# EAGLE design lada_v2 (EAGLE 7.2.0)
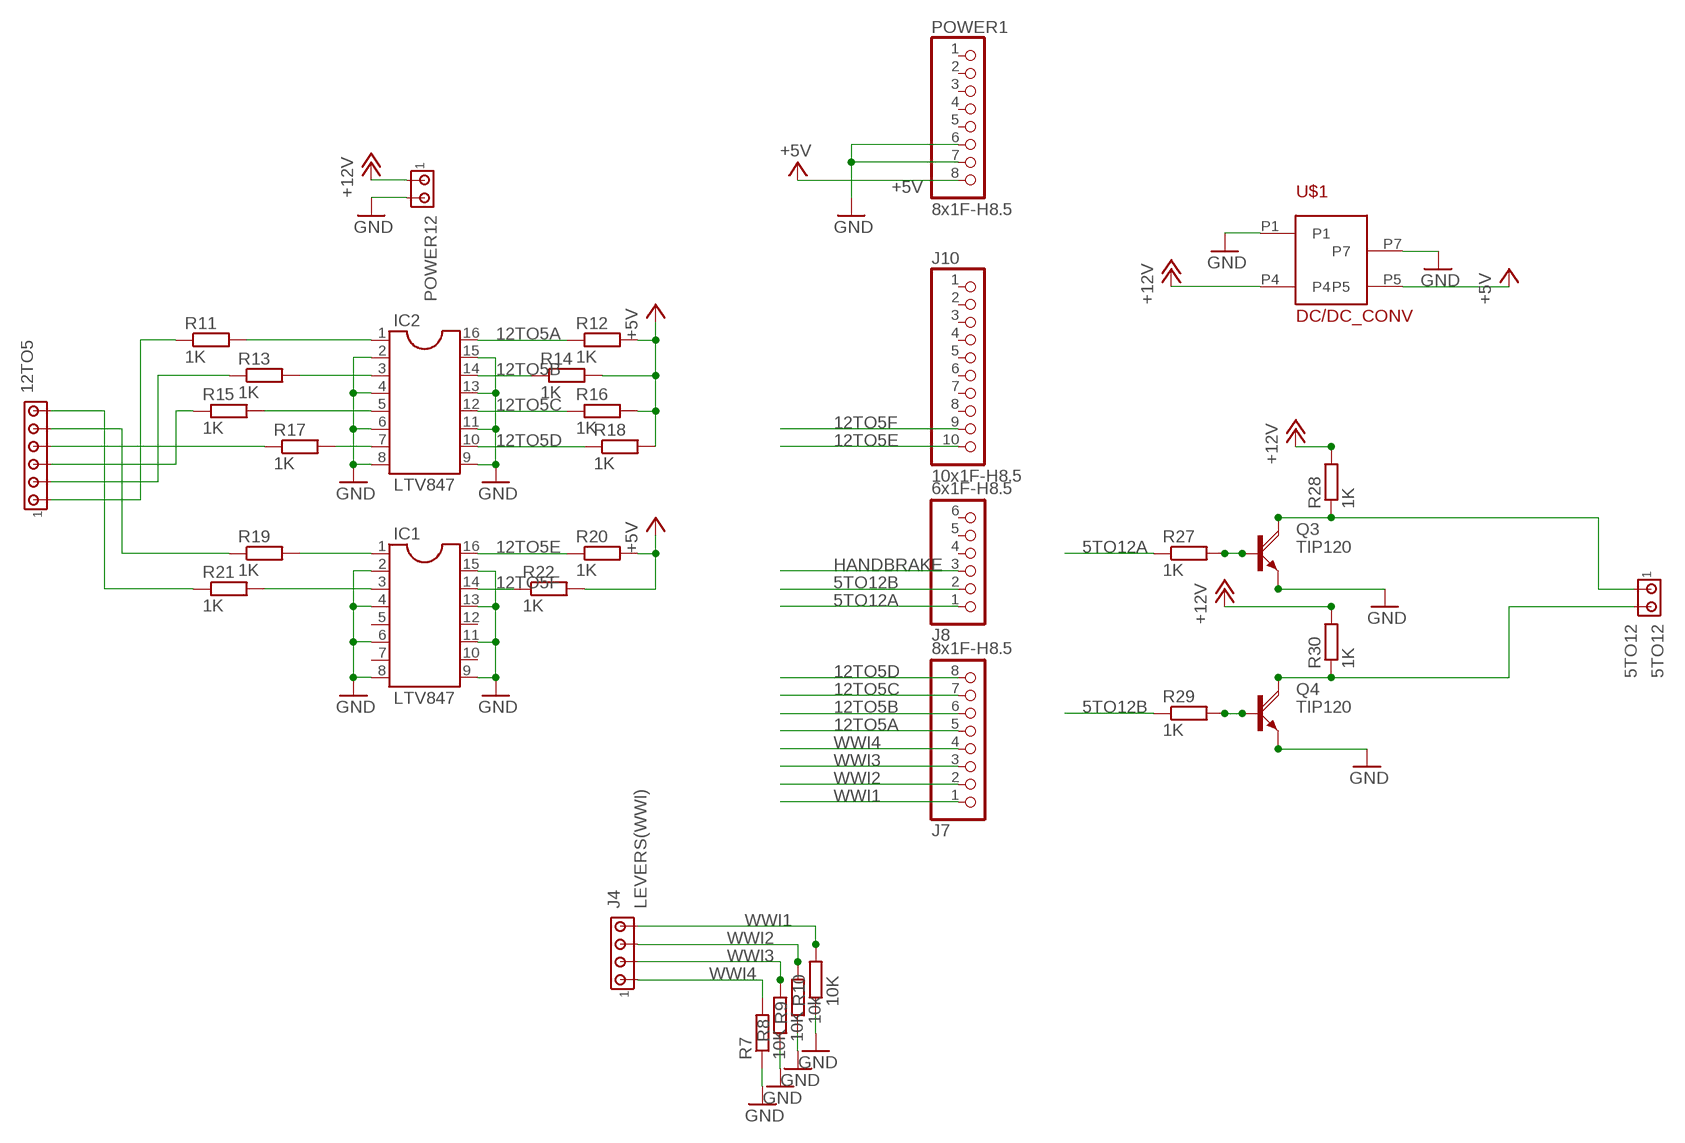
[diagram p0: schematic, sheet 1]

## Parts
5TO12  5TO12  MTA02-100  [10X02MTA]
12TO5  MTA06-100  [10X06MTA]
IC1  LTV847  DIL16  [DIL16]
IC2  LTV847  DIL16  [DIL16]
J4  LEVERS(WWI)  MTA04-100  [10X04MTA]
J7  8x1F-H8.5  PINHD-1X8  [1X08]
J8  6x1F-H8.5  PINHD-1X6  [1X06]
J10  10x1F-H8.5  PINHD-1X10  [1X10]
POWER1  8x1F-H8.5  PINHD-1X8  [1X08]
POWER12  MTA02-100  [10X02MTA]
Q3  TIP120  [TO220AH]
Q4  TIP120  [TO220AH]
R7  10K  R-EU_0207/10  [0207/10]
R8  10K  R-EU_0207/10  [0207/10]
R9  10k  R-EU_0207/10  [0207/10]
R10  10K  R-EU_0207/10  [0207/10]
R11  1K  R-EU_0207/10  [0207/10]
R12  1K  R-EU_0207/10  [0207/10]
R13  1K  R-EU_0207/10  [0207/10]
R14  1K  R-EU_0207/10  [0207/10]
R15  1K  R-EU_0207/10  [0207/10]
R16  1K  R-EU_0207/10  [0207/10]
R17  1K  R-EU_0207/10  [0207/10]
R18  1K  R-EU_0207/10  [0207/10]
R19  1K  R-EU_0207/10  [0207/10]
R20  1K  R-EU_0207/10  [0207/10]
R21  1K  R-EU_0207/10  [0207/10]
R22  1K  R-EU_0207/10  [0207/10]
R27  1K  R-EU_0207/10  [0207/10]
R28  1K  R-EU_0207/10  [0207/10]
R29  1K  R-EU_0207/10  [0207/10]
R30  1K  R-EU_0207/10  [0207/10]
U$1  DC/DC_CONV  [DC/DC_CONV]

## Nets
5TO12A: J8.1 R27.1
5TO12B: J8.2 R29.1
12TO5A: IC2.16 J7.5 R12.1
12TO5B: IC2.14 J7.6 R14.1
12TO5C: IC2.12 J7.7 R16.1
12TO5D: IC2.10 J7.8 R18.1
12TO5E: IC1.16 J10.10 R20.1
12TO5F: IC1.14 J10.9 R22.1
+5V: POWER1.8 R12.2 R14.2 R16.2 R18.2 R20.2 R22.2 U$1.P5
+12V: POWER12.1 R28.2 R30.2 U$1.P4
GND: IC1.2 IC1.4 IC1.6 IC1.8 IC1.9 IC1.11 IC1.13 IC1.15 IC2.2 IC2.4 IC2.6 IC2.8 IC2.9 IC2.11 IC2.13 IC2.15 POWER1.6 POWER1.7 POWER12.2 Q3.E Q4.E R7.1 R8.1 R9.1 R10.1 U$1.P1 U$1.P7
HANDBRAKE: J8.3
N$60: 5TO12.1 Q3.C R28.1
N$61: 5TO12.2 Q4.C R30.1
N$64: Q4.B R29.2
N$65: Q3.B R27.2
N$120: IC1.1 R19.2
N$121: IC1.3 R21.2
N$128: IC2.1 R11.2
N$129: IC2.3 R13.2
N$130: IC2.5 R15.2
N$131: IC2.7 R17.2
N$132: 12TO5.1 R11.1
N$133: 12TO5.2 R13.1
N$134: 12TO5.3 R15.1
N$135: 12TO5.4 R17.1
N$136: 12TO5.5 R19.1
N$137: 12TO5.6 R21.1
WWI1: J4.4 J7.1 R10.2
WWI2: J4.3 J7.2 R9.2
WWI3: J4.2 J7.3 R8.2
WWI4: J4.1 J7.4 R7.2
Unconnected: IC1.5 IC1.7 IC1.10 IC1.12 J8.4 J8.5 J8.6 J10.1 J10.2 J10.3 J10.4 J10.5 J10.6 J10.7 J10.8 POWER1.1 POWER1.2 POWER1.3 POWER1.4 POWER1.5

## Library data of the parts
5TO12 POWER12 = con-amp:MTA02-100: AMP connector
12TO5 = con-amp:MTA06-100: AMP connector Connection corrected 2014-09-19
IC1 IC2 = ic-package:DIL16: Dual In Line / Socket
J4 = con-amp:MTA04-100: AMP connector
J7 POWER1 = SmartPrj:PINHD-1X8: PIN HEADER
J8 = SmartPrj:PINHD-1X6: PIN HEADER
J10 = SmartPrj:PINHD-1X10: PIN HEADER
Q3 Q4 = transistor-power:TIP120: NPN DARLINGTON TRANSISTOR
R7-R22 R27-R30 = rcl:R-EU_: RESISTOR, European symbol
U$1 = dc-dc_meanwell:DC/DC_CONV

## Net classes
0 default: width 0.152 mm, drill 0.61 mm, clearance 0.152 mm
1 power: width 0.152 mm, drill 0.61 mm, clearance 0.152 mm
2 VIN: width 0.61 mm, drill 0.61 mm, clearance 0.254 mm

## Board
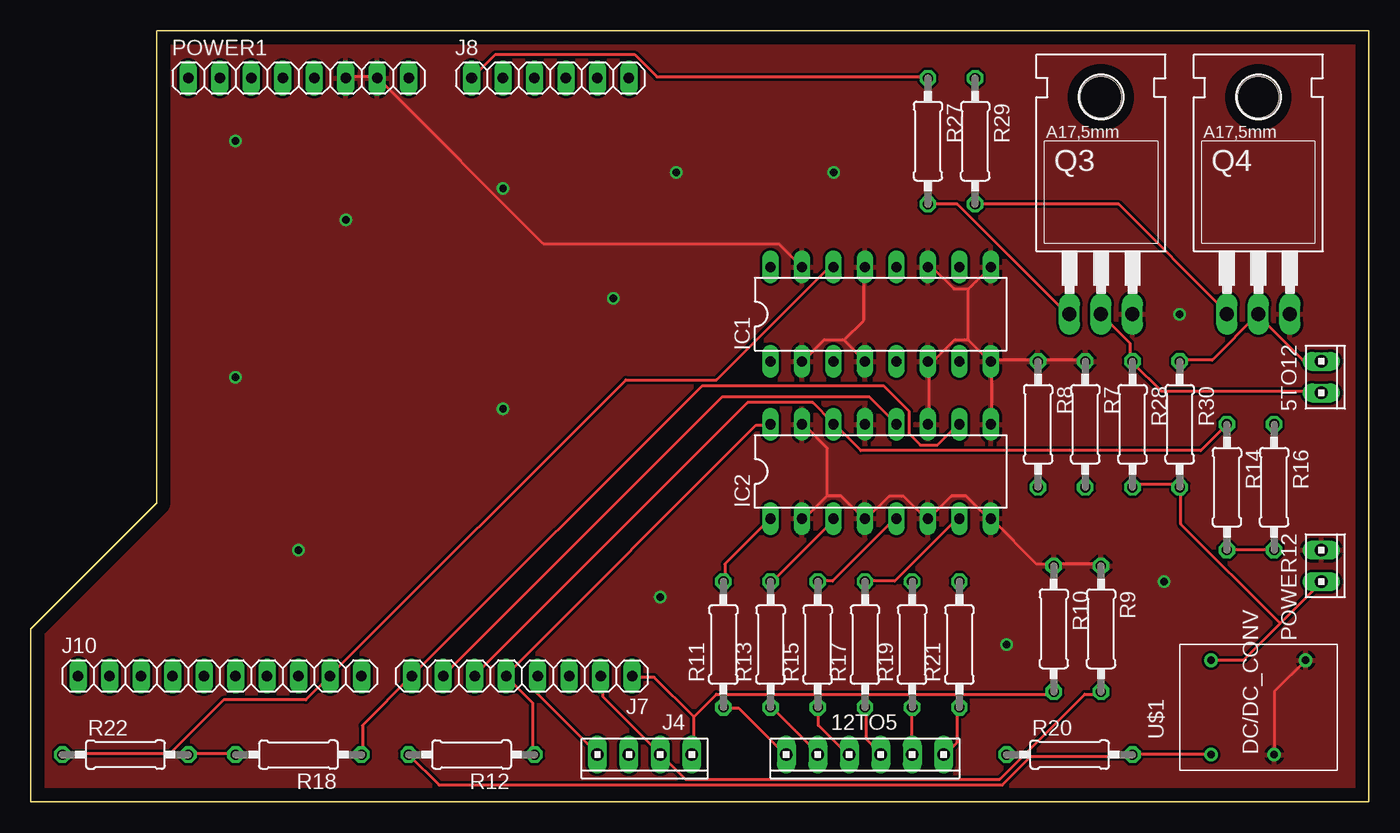
[diagram p1: board, top side]
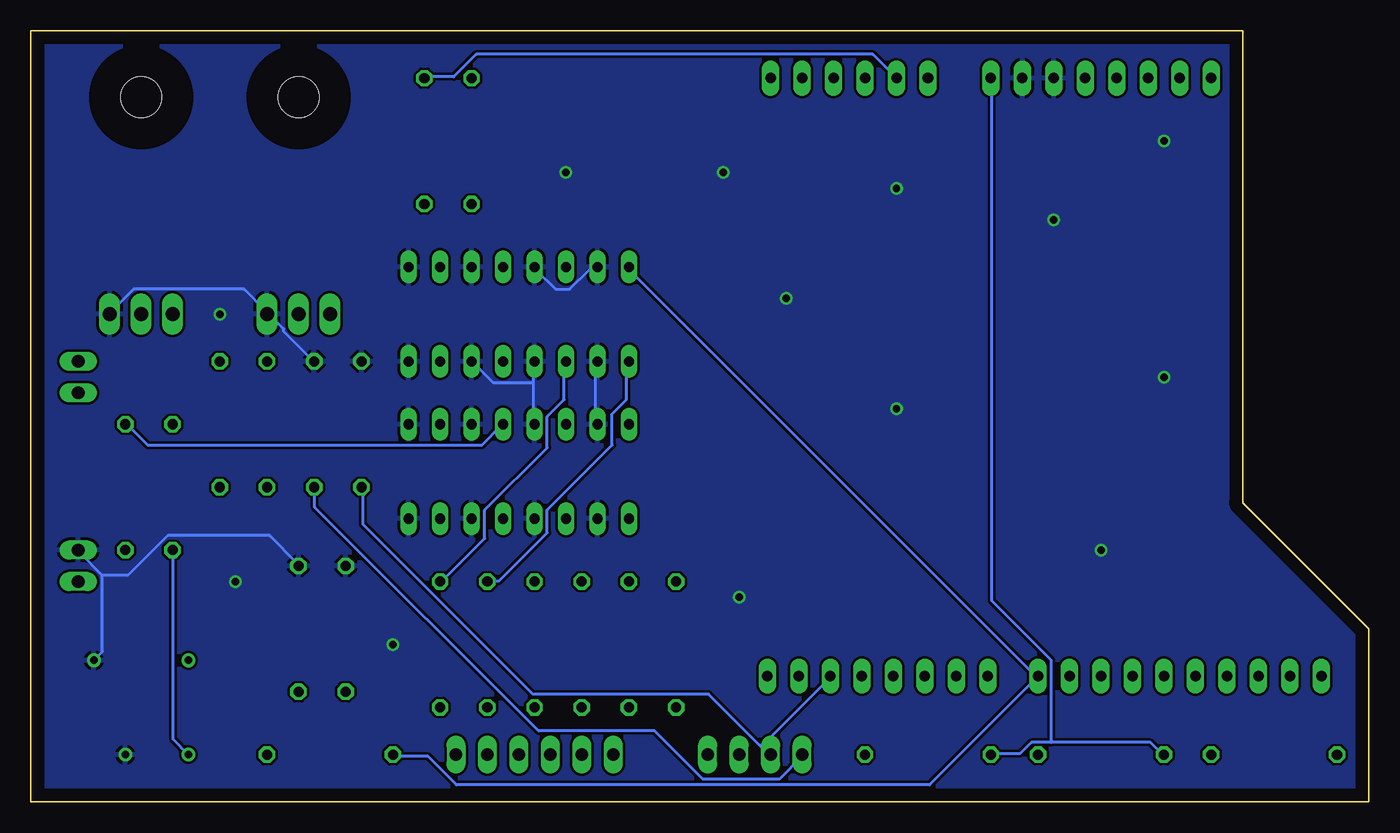
[diagram p2: board, bottom side, seen from below]

Size 107.95 x 62.23 mm. Coordinates in mm from the lower left corner, seen from the top.
Outline: 10.16,62.23 10.16,24.13 0,13.97 0,0 107.95,0 107.95,62.23 10.16,62.23
Copper layers (1*16): Top 0.035mm / dielectric 1.5mm / Bottom 0.035mm
Design rules "default *": minimum track width 10mil, minimum drill 20mil, track to track 8mil, track to pad 8mil, pad to pad 8mil, via to via 8mil, smd to smd 8mil, copper to edge 40mil, drill to drill 8mil, minimum pad ring 10mil, minimum via ring 8mil, stop-mask expansion 4mil, vias tented up to drill 0mil, thermal gap 10mil

### Footprints (pad centres in the part's own frame; a part is rotated, then mirrored left to right if it is on the bottom)
10X02MTA = drill 1.016 long: 1 1.27,0; 2 -1.27,0
10X06MTA = drill 1.016 long: 1 6.35,0; 2 3.81,0; 3 1.27,0; 4 -1.27,0; 5 -3.81,0; 6 -6.35,0
DIL16 = drill 0.813 long: 1 -8.89,-3.81; 2 -6.35,-3.81; 3 -3.81,-3.81; 4 -1.27,-3.81; 5 1.27,-3.81; 6 3.81,-3.81; 7 6.35,-3.81; 8 8.89,-3.81; 9 8.89,3.81; 10 6.35,3.81; 11 3.81,3.81; 12 1.27,3.81; 13 -1.27,3.81; 14 -3.81,3.81; 15 -6.35,3.81; 16 -8.89,3.81
10X04MTA = drill 1.016 long: 1 3.81,0; 2 1.27,0; 3 -1.27,0; 4 -3.81,0
1X08 = drill 0.85 pad 1.422 long: 1 -8.89,0; 2 -6.35,0; 3 -3.81,0; 4 -1.27,0; 5 1.27,0; 6 3.81,0; 7 6.35,0; 8 8.89,0
1X06 = drill 0.85 pad 1.422 long: 1 -6.35,0; 2 -3.81,0; 3 -1.27,0; 4 1.27,0; 5 3.81,0; 6 6.35,0
1X10 = drill 0.85 pad 1.422 long: 1 -11.43,0; 2 -8.89,0; 3 -6.35,0; 4 -3.81,0; 5 -1.27,0; 6 1.27,0; 7 3.81,0; 8 6.35,0; 9 8.89,0; 10 11.43,0
TO220AH = drill 1.118 long: B -2.54,-6.35; C 0,-6.35; E 2.54,-6.35 | hole 3.302: 0,11.176
0207/10 = drill 0.813 octagon: 1 -5.08,0; 2 5.08,0
DC/DC_CONV = drill 0.6: P1 8.89,2.54; P4 8.89,10.16; P5 1.27,10.16; P7 1.27,5.08

### Placement (x,y rotation side)
5TO12  104.14,34.29 270 top
12TO5  67.31,3.81 180 top
IC1  68.58,39.37 0 top
IC2  68.58,26.67 0 top
J4  49.53,3.81 180 top
J7  39.62,10.16 180 top
J8  41.91,58.42 0 top
J10  15.24,10.16 0 top
POWER1  21.59,58.42 0 top
POWER12  104.14,19.05 270 top
Q3  86.36,45.72 0 top
Q4  99.06,45.72 0 top
R7  85.09,30.48 270 top
R8  81.28,30.48 270 top
R9  86.36,13.97 270 top
R10  82.55,13.97 270 top
R11  55.88,12.7 90 top
R12  35.56,3.81 180 top
R13  59.69,12.7 90 top
R14  96.52,25.4 270 top
R15  63.5,12.7 90 top
R16  100.33,25.4 270 top
R17  67.31,12.7 90 top
R18  21.59,3.81 180 top
R19  71.12,12.7 90 top
R20  83.82,3.81 0 top
R21  74.93,12.7 90 top
R22  7.62,3.81 0 top
R27  72.39,53.34 270 top
R28  88.9,30.48 270 top
R29  76.2,53.34 270 top
R30  92.71,30.48 270 top
U$1  105.41,2.54 90 top

### Tracks (layer width: path | path; a pad name or v marks a point on that pad's centre or on a via)
5TO12A
  Top 0.254: J8.1 37.49,60.35 48.69,60.35 50.52,58.52 72.24,58.52 R27.1
5TO12B
  Bottom 0.254: R29.1 76.12,58.52 73.84,58.52 72.01,60.35 40.01,60.35 38.18,58.52 J8.2
12TO5A
  Top 0.254: R12.1 40.46,3.89 40.46,8 38.41,10.06 J7.5 38.41,10.29 58.52,30.4 59.66,30.4 IC2.16
12TO5B
  Top 0.254: R14.1 96.47,30.4 94.41,28.35 66.98,28.35 64.92,30.4 IC2.14 64.69,30.63 63.09,32.23 57.84,32.23 35.89,10.29 J7.6
12TO5C
  Top 0.254: J7.7 33.38,10.29 55.78,32.69 67.67,32.69 69.72,30.63 IC2.12
  Bottom 0.254: IC2.12 69.95,30.4 71.55,28.8 98.53,28.8 100.13,30.4 R16.1
12TO5D
  Top 0.254: R18.1 26.75,3.89 26.75,6.17 J7.8 54.18,33.6 68.81,33.6 70.87,31.55 70.87,29.72 71.78,28.8 73.15,28.8 74.75,30.4 IC2.10
12TO5E
  Bottom 0.254: 26.75,10.06 35.43,1.37 73.61,1.37 75.89,3.66 78.64,3.66 R20.1 | 26.75,10.06 59.66,42.98 IC1.16 | 26.75,10.06 J10.10
12TO5F
  Top 0.254: R22.1 2.74,3.89 11.2,3.89 15.54,8.23 22.17,8.23 24,10.06 J10.9 24.23,10.29 48.01,34.06 55.32,34.06 64.24,42.98 64.69,42.98 IC1.14
+5V
  Top 0.254: R14.2 96.7,20.34 100.13,20.34 R16.2 | U$1.P5 95.1,3.89 88.92,3.89 R20.2 88.7,3.66 80.7,3.66 78.41,1.37 32.92,1.37 R12.2 | R22.2 12.8,3.89 16.46,3.89 R18.2
  Bottom 0.254: U$1.P5 96.47,5.03 96.47,20.12 R14.2 | 25.6,4.8 17.6,4.8 16.69,3.89 R18.2 | 25.6,4.8 27.2,4.8 28.12,3.89 30.4,3.89 R12.2 | 25.6,4.8 25.6,11.43 30.4,16.23 30.4,58.29 POWER1.8
+12V
  Top 0.254: R28.2 88.92,25.6 92.58,25.6 R30.2 92.81,25.38 92.81,22.4 100.81,14.4 | U$1.P4 97.84,11.43 100.81,14.4 | 100.81,14.4 104.01,17.6 POWER12.1
GND  (via drill 0.6)
  Top 0.254: POWER1.6 25.6,58.52 27.89,58.52 POWER1.7 28.12,58.29 41.38,45.03 60.35,45.03 62.18,43.2 IC1.15 | U$1.P1 100.36,8.91 100.36,3.89 U$1.P7 | R9.1 86.18,19.2 82.75,19.2 R10.1 82.53,19.2 81.15,19.2 77.5,22.86 IC2.8 77.27,22.86 75.44,24.69 74.3,24.69 72.47,22.86 IC2.6 72.24,22.86 70.41,24.69 69.27,24.69 67.44,22.86 IC2.4 67.21,22.86 65.38,24.69 64.24,24.69 | 64.24,24.69 62.41,22.86 IC2.2 | 64.24,24.69 64.24,28.57 62.41,30.4 IC2.15 | IC2.11 72.47,30.63 72.47,35.43 IC1.6 72.47,35.66 72.92,35.66 74.52,37.26 75.67,37.26 | 75.67,41.38 74.52,41.38 72.92,42.98 72.47,42.98 IC1.11 | IC1.9 75.67,41.38 | IC2.9 77.5,30.63 77.5,35.43 IC1.8 | R7.1 85.04,35.66 81.38,35.66 R8.1 81.15,35.66 77.5,35.66 IC1.8 | 75.67,37.26 75.67,41.38 | 75.67,37.26 77.27,35.66 IC1.8 | 65.61,37.26 64.01,37.26 62.41,35.66 IC1.2 | IC1.4 65.61,37.26 | 65.61,37.26 67.21,38.86 67.21,42.98 IC1.13
  Bottom 0.254: IC1.15 62.41,42.98 62.87,42.98 64.47,41.38 65.61,41.38 67.21,42.98 IC1.13 | 102.18,18.29 104.01,20.12 POWER12.2 | 102.18,18.29 102.18,12.12 U$1.P1 | IC2.15 62.41,30.63 62.41,35.43 IC1.2 | 67.44,33.83 67.44,35.43 IC1.4 | 67.44,33.83 67.44,30.63 IC2.13 | 67.44,33.83 70.64,33.83 72.24,35.43 IC1.6 | R7.1 85.27,35.66 87.55,37.95 87.55,38.18 88.7,39.32 Q3.E 88.92,39.55 90.75,41.38 99.67,41.38 101.5,39.55 Q4.E | 102.18,18.29 100.13,18.29 96.93,21.49 88.7,21.49 86.41,19.2 R9.1
  other vias: 16.51,53.34 25.4,46.99 16.51,34.29 21.59,20.32 38.1,31.75 38.1,49.53 46.99,40.64 52.07,50.8 64.77,50.8 92.71,39.37 91.44,17.78 78.74,12.7 50.8,16.51
  pour Top: 10.16,62.23 107.95,62.23 107.95,0 0,0 0,13.97 10.16,24.13
  pour Bottom: 10.16,62.23 107.95,62.23 107.95,0 0,0 0,13.97 10.16,24.13
N$60
  Top 0.254: Q3.C 88.7,37.03 88.7,35.66 R28.1 88.92,35.43 91.21,33.15 104.01,33.15 5TO12.1
N$61
  Top 0.254: 98.98,39.32 95.33,35.66 92.81,35.66 R30.1 | 98.98,39.32 102.64,35.66 104.01,35.66 5TO12.2 | 98.98,39.32 Q4.C
N$64
  Top 0.254: R29.2 76.35,48.23 87.78,48.23 96.47,39.55 Q4.B
N$65
  Top 0.254: R27.2 72.47,48.23 74.75,48.23 83.67,39.32 Q3.B
N$120
  Bottom 0.254: IC1.1 59.89,35.43 59.89,32.46 61.04,31.32 61.04,28.8 66.29,23.55 66.29,21.72 70.18,17.83 71.09,17.83 R19.2
N$121
  Bottom 0.254: IC1.3 64.92,35.43 64.92,32.46 66.29,31.09 66.29,28.57 71.32,23.55 71.32,21.26 74.75,17.83 R21.2
N$128
  Top 0.254: R11.2 56.01,17.83 56.01,19.2 59.66,22.86 IC2.1
N$129
  Top 0.254: R13.2 59.89,17.83 64.92,22.86 IC2.3
N$130
  Top 0.254: R15.2 63.55,17.83 64.69,17.83 69.72,22.86 IC2.5
N$131
  Top 0.254: R17.2 67.44,17.83 69.72,17.83 74.75,22.86 IC2.7
N$132
  Top 0.254: R11.1 56.01,7.54 57.15,7.54 60.81,3.89 12TO5.1
N$133
  Top 0.254: R13.1 59.89,7.54 63.55,3.89 12TO5.2
N$134
  Top 0.254: R15.1 63.55,7.54 63.55,6.17 65.84,3.89 12TO5.3
N$135
  Top 0.254: R17.1 67.44,7.54 67.44,5.03 68.58,3.89 12TO5.4
N$136
  Top 0.254: R19.1 71.09,7.54 71.09,3.89 12TO5.5
N$137
  Top 0.254: R21.1 74.75,7.54 74.75,4.8 73.84,3.89 12TO5.6
WWI1
  Top 0.254: 53.49,6.86 55.32,8.69 82.53,8.69 R10.2 | 53.49,6.86 53.49,3.89 J4.4 | 53.49,6.86 50.29,10.06 48.69,10.06 J7.1
WWI2
  Top 0.254: R9.2 86.18,8.69 85.04,8.69 78.18,1.83 52.81,1.83 50.98,3.66 J4.3 50.75,3.89 46.18,8.46 46.18,10.06 J7.2
WWI3
  Bottom 0.254: 49.15,4.57 48.46,3.89 J4.2 | 49.15,4.57 53.26,8.69 67.44,8.69 81.15,22.4 81.15,25.38 R8.2 | 49.15,4.57 48.92,4.57 43.43,10.06 J7.3
WWI4
  Top 0.254: J7.4 40.92,10.06 40.92,8.69 45.72,3.89 J4.1
  Bottom 0.254: R7.2 85.04,25.38 85.04,23.77 66.98,5.71 57.61,5.71 53.72,1.83 47.55,1.83 45.72,3.66 J4.1